# EAGLE design nadajnik (EAGLE 8.5.0)
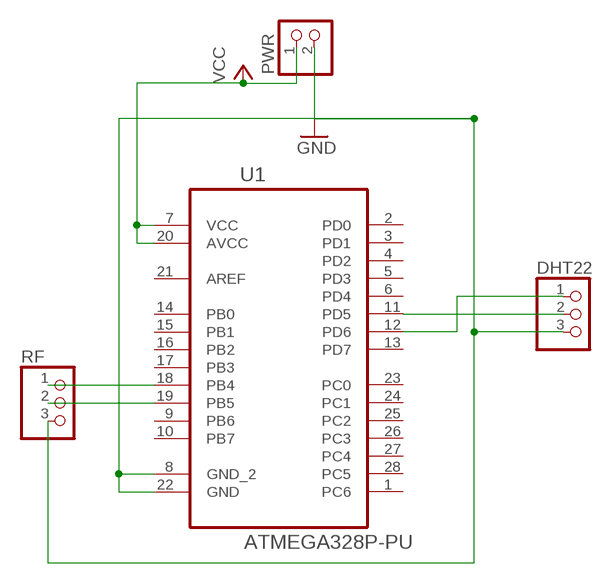
[diagram p0: schematic, sheet 1]

## Parts
DHT22  PINHD-1X3  [1X03]
PWR  PINHD-1X2  [1X02]
RF  PINHD-1X3  [1X03]
U1  ATMEGA328P-PU  [DIP254P762X457-28]

## Nets
GND: DHT22.3 PWR.2 RF.3 U1.8(GND_2) U1.22(GND)
N$1: DHT22.1 U1.12(PD6)
N$2: DHT22.2 U1.11(PD5)
N$3: RF.1 U1.18(PB4)
N$4: RF.2 U1.19(PB5)
VCC: PWR.1 U1.7(VCC) U1.20(AVCC)
Unconnected: U1.1(PC6) U1.2(PD0) U1.3(PD1) U1.4(PD2) U1.5(PD3) U1.6(PD4) U1.9(PB6) U1.10(PB7) U1.13(PD7) U1.14(PB0) U1.15(PB1) U1.16(PB2) U1.17(PB3) U1.21(AREF) U1.23(PC0) U1.24(PC1) U1.25(PC2) U1.26(PC3) U1.27(PC4) U1.28(PC5)

## Library data of the parts
DHT22 RF = pinhead:PINHD-1X3: PIN HEADER
PWR = pinhead:PINHD-1X2: PIN HEADER
U1 = Atmel_By_element14_Batch_1-00:ATMEGA328P-PU: 8-bit Microcontroller with In-System Programmable Flash; MPN: ATMEGA328P-PU; OC_FARNELL: 1715487; OC_NEWARK: 15R0268; PACKAGE: PDIP-28; SUPPLIER: Atmel

## Board
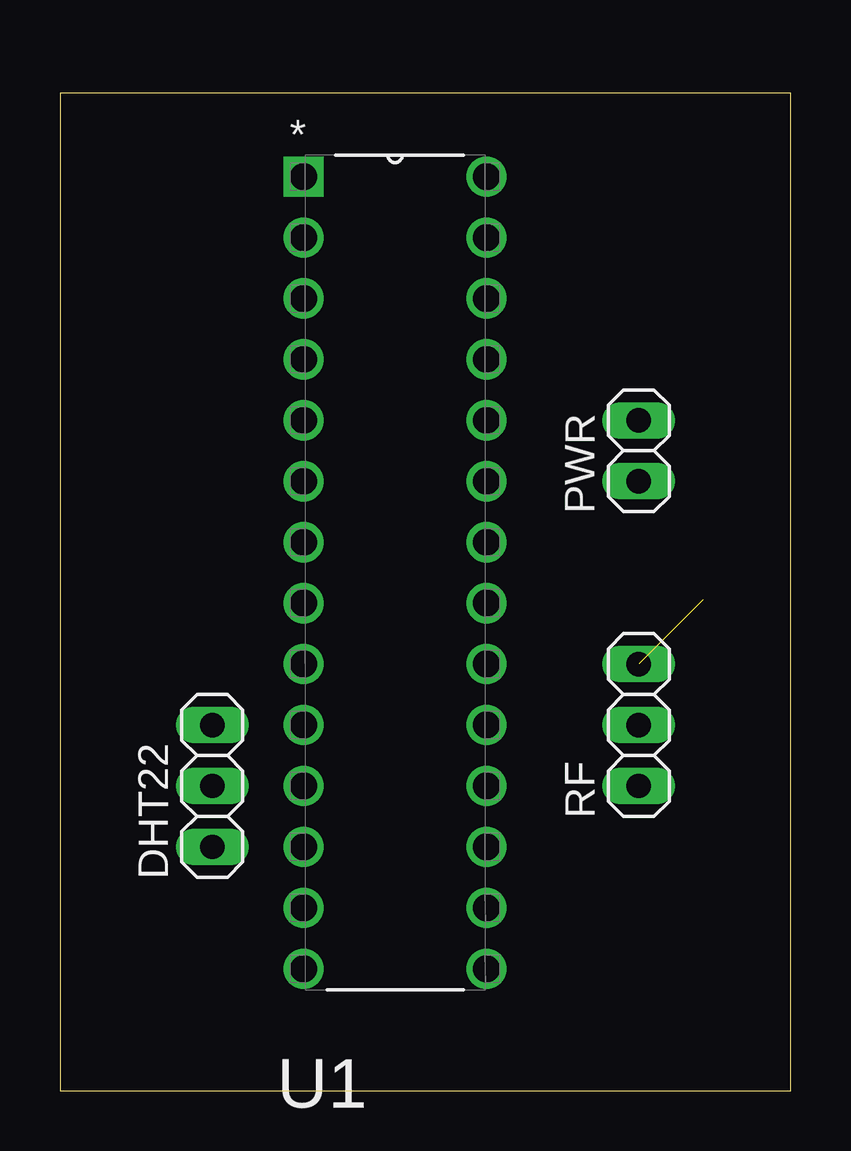
[diagram p1: board, top side]
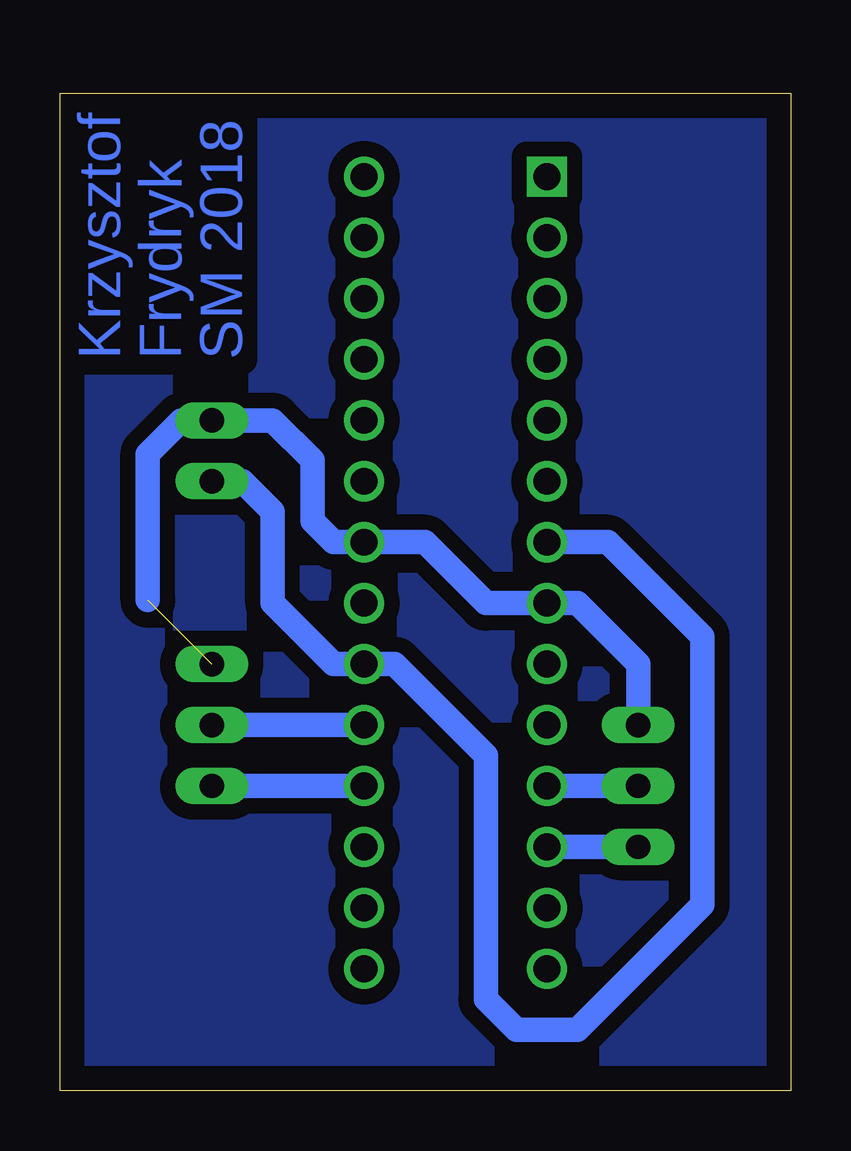
[diagram p2: board, bottom side, seen from below]

Size 30.46 x 41.58 mm. Coordinates in mm from the lower left corner, seen from the top.
Outline: 0,0 30.46,0 30.46,41.58 0,41.58 0,0
Copper layers (1*16): Top 0.035mm / dielectric 1.5mm / Bottom 0.035mm
Design rules "default *": minimum track width 25mil, minimum drill 0.35mm, track to track 25mil, track to pad 25mil, pad to pad 25mil, via to via 25mil, smd to smd 6mil, copper to edge 40mil, drill to drill 6mil, minimum pad ring 10mil, minimum via ring 8mil, stop-mask expansion 4mil, vias tented up to drill 0mil, thermal gap 10mil

### Footprints (pad centres in the part's own frame; a part is rotated, then mirrored left to right if it is on the bottom)
1X03 = drill 1.016 long: 1 -2.54,0; 2 0,0; 3 2.54,0
1X02 = drill 1.016 long: 1 -1.27,0; 2 1.27,0
DIP254P762X457-28 = drill 1.118 square: 1 -7.62,33.02 | drill 1.118: 2 -7.62,30.48; 3 -7.62,27.94; 4 -7.62,25.4; 5 -7.62,22.86; 6 -7.62,20.32; 7 -7.62,17.78; 8 -7.62,15.24; 9 -7.62,12.7; 10 -7.62,10.16; 11 -7.62,7.62; 12 -7.62,5.08; 13 -7.62,2.54; 14 -7.62,0; 15 0,0; 16 0,2.54; 17 0,5.08; 18 0,7.62; 19 0,10.16; 20 0,12.7; 21 0,15.24; 22 0,17.78; 23 0,20.32; 24 0,22.86; 25 0,25.4; 26 0,27.94; 27 0,30.48; 28 0,33.02

### Placement (x,y rotation side)
DHT22  6.35,12.7 90 top
PWR  24.13,26.67 90 top
RF  24.13,15.24 90 top
U1  17.78,5.08 0 top

### Tracks (layer width: path | path; a pad name or v marks a point on that pad's centre or on a via)
GND  (1 unrouted)
  Bottom 1.016: DHT22.3 6.35,17.78 8.89,20.32 U1.8 12.7,20.32 15.24,22.86 U1.22 19.05,22.86 19.94,23.75 19.94,26.29 21.59,27.94 PWR.2 25.4,27.94 26.8,26.54 26.8,20.45
N$1
  Bottom 1.016: DHT22.1 U1.12
N$2
  Bottom 1.016: DHT22.2 U1.11
N$3
  Bottom 1.016: RF.1 U1.18
N$4
  Bottom 1.016: RF.2 U1.19
N$5
  pour Bottom: 0,0 30.48,0 30.48,41.91 0,41.91
VCC
  Bottom 1.016: U1.7 7.62,22.86 3.68,18.92 3.68,7.75 8.89,2.54 11.43,2.54 12.7,3.81 12.7,13.97 16.51,17.78 U1.20 19.05,17.78 21.59,20.32 21.59,24.13 22.86,25.4 PWR.1

### Text on the board
Bottom: SM 2018 | Frydryk | Krzysztof